# Altium schematic sheet Wireless Charging.SchDoc
size A; SheetNumber: 5; SheetTotal: 6
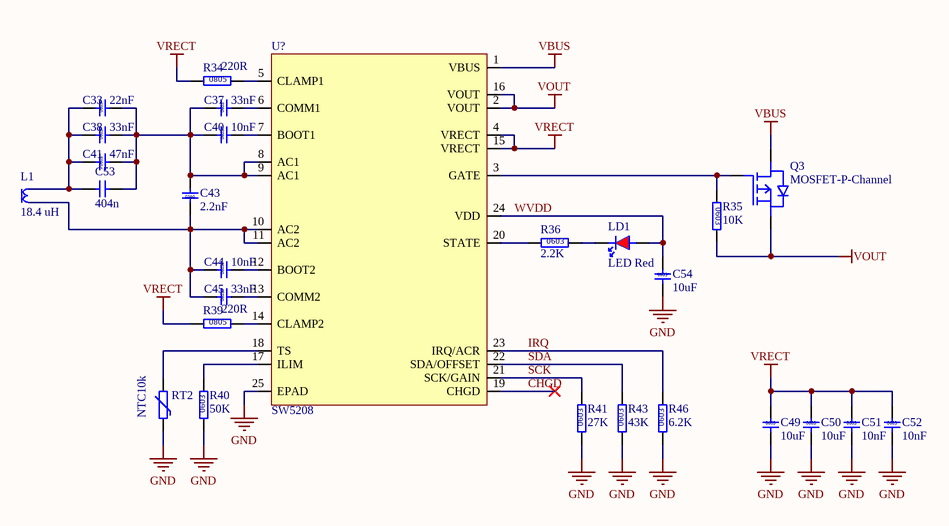
[diagram p0: Wireless Charging.SchDoc]

## Parts
C33  22nF  [C0603]
C37  33nF  [C0603]
C38  33nF  [C0603]
C40  10nF  [C0603]
C41  47nF  [C0603]
C43  2.2nF  [C0603]
C44  10nF  [C0603]
C45  33nF  [C0603]
C49  10uF  [C0805]
C50  10uF  [C0805]
C51  10nF  [C0603]
C52  10nF  [C0603]
C53  404n  [CBB Capacitor-7.1mm-WO3D]
C54  10uF  [C0805]
L1  18.4 uH  [SMD PAD 1x2]
LD1  LED Red  [LED-0603-RED]
Q3  MOSFET-P-Channel  [PMOS-SOT23]
R34  220R  [R0805-LD]
R35  10K  [R0603-LD]
R36  2.2K  [R0603-LD]
R39  220R  [R0805-LD]
R40  50K  [R0603-LD]
R41  27K  [R0603-LD]
R43  43K  [R0603-LD]
R46  6.2K  [R0603-LD]
RT2  NTC10k  [RT0603]
U?  SW5208  [QFN-24-4x4-0.5P]

## Nets
GND: C49.2 C50.2 C51.2 C52.2 C54.2 R40.1 R41.1 R43.1 R46.1 RT2.1 U?.25(EPAD)
VBUS: Q3.2(D) U?.1(VBUS)
VOUT: Q3.3(S) R35.2 U?.2(VOUT) U?.16(VOUT)
VRECT: C49.1 C50.1 C51.1 C52.1 R34.1 R39.1 U?.4(VRECT) U?.15(VRECT)
CHGD: U?.19(CHGD)
IRQ: R46.2 U?.23(IRQ/ACR)
SCK: R41.2 U?.21(SCK/GAIN)
SDA: R43.2 U?.22(SDA/OFFSET)
WVDD: C54.1 LD1.1(A) U?.24(VDD)
NetC33_1: C33.1 C38.1 C41.1 C53.2 L1.2
NetC33_2: C33.2 C37.1 C38.2 C40.1 C41.2 C43.2 C53.1 U?.8(AC1) U?.9(AC1)
NetC37_2: C37.2 U?.6(COMM1)
NetC40_2: C40.2 U?.7(BOOT1)
NetC43_1: C43.1 C44.1 C45.1 L1.1 U?.10(AC2) U?.11(AC2)
NetC44_2: C44.2 U?.12(BOOT2)
NetC45_2: C45.2 U?.13(COMM2)
NetLD1_2: LD1.2(K) R36.2
NetQ3_1: Q3.1(G) R35.1 U?.3(GATE)
NetR34_2: R34.2 U?.5(CLAMP1)
NetR36_1: R36.1 U?.20(STATE)
NetR39_2: R39.2 U?.14(CLAMP2)
NetR40_2: R40.2 U?.17(ILIM)
NetRT2_2: RT2.2 U?.18(TS)

## Notes on the sheet
- (in symbol C 0603 2.2nF 50V) 0603
- (in symbol C 0603 10nF 50V) 0603
- (in symbol C 0805 10uF 25V) 0805
- (in symbol R 0603 2.7K) 0603
- (in symbol R 0603 2K) 0603
- (in symbol R 0603 10K) 0603
- (in symbol R 0603 51K) 0603
- (in symbol R 0805 120R) 0805

## Library data of the parts
C33 C37 C38 C40 C41 C44 C45 C51 C52 = C 0603 10nF 50V: 10% 50V; Part No: W-T-CA-X703N10K50VNT; Material Name: 贴片电容0603 10NF/50V 10%; Product Code: WP0003409; Supplier: 南京南山半导体有限公司; Manufacturer: *
C43 = C 0603 2.2nF 50V: 10% 50V; Part No: WP0005364; Material Name: 贴片电容0603 2.2nF/50V 10%; Product Code: WP0005364; Supplier: 南京南山半导体有限公司; Manufacturer: *
C49 C50 C54 = C 0805 10uF 25V: 10% 25V; Part No: WP0005368; Material Name: 贴片电容0805 10UF/25V 10%; Product Code: WP0005368; Supplier: 深圳市四叶电子有限公司; Manufacturer: *
C53 = Capacitor: CBB Capacitor 404n 100V; Part No: *; Product Code: *; Suppliers: 南京南山半导体有限公司; Manufacturer: *
L1 = Wcoil: SMD Inductor
R34 R39 = R 0805 120R: 5%; Part No: W-T-RE-RS05K121JT; Material Name: 贴片电阻0805 120Ω 5%; Product Code: WP0003450; Supplier: 南京南山半导体有限公司; Manufacturer: *
R35 = R 0603 10K: 5%; Part No: W-T-RE-RS03K103JT; Manufacturer: 热敏D541V11增加1颗用量; Material Name: 贴片电阻0603 10K 5%; Product Code: WP0002708; Supplier: 南京南山半导体有限公司
R36 = R 0603 2.7K: 5%; Part No: W-T-RE-RS03K272JT; Material Name: 贴片电阻0603 2.7K 5%; Product Code: WP0002877; Supplier: 南京南山半导体有限公司
R40 = R 0603 51K: 1%; Part No: WP0005360; Material Name: 贴片电阻0603 51K 1%; Product Code: WP0005360; Supplier: 南京南山半导体有限公司; Manufacturer: *
R41 R43 R46 = R 0603 2K: 1%; Part No: W-T-RE-RS03K202FT; Material Name: 贴片电阻0603 2K 1%; Product Code: WP0002768; Supplier: 南京南山半导体有限公司; Manufacturer: *
RT2 = Thermistor
LD1 = LED Red: Part No: *; Product Code: *; Suppliers: *; Manufacturer: *
Q3 = MOSFET-P-Channel: Part No: *; Product Code: *; Suppliers: *; Manufacturer: *